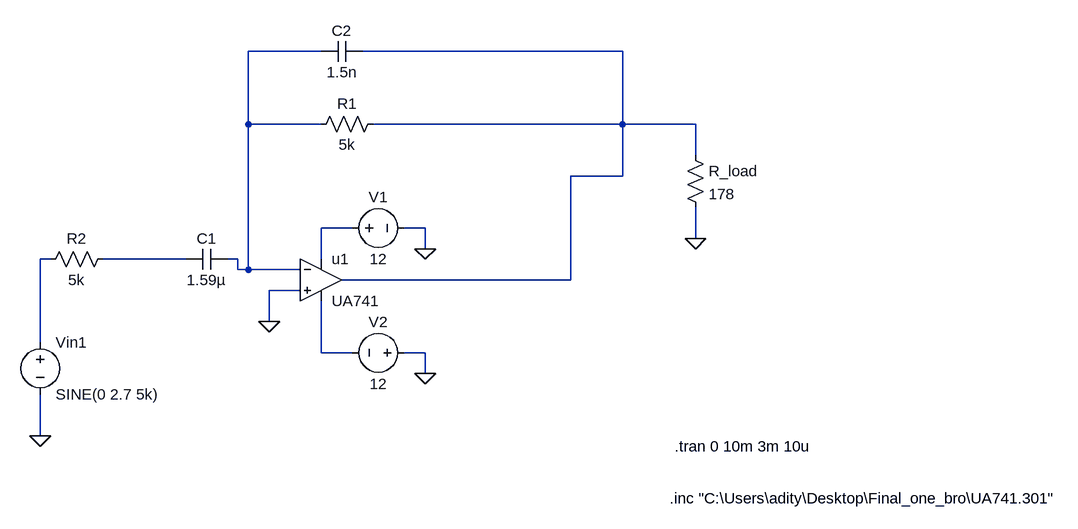
[diagram p0: schematic Filter.asc]
Filter.asc, the LTspice schematic file:
Version 4
SHEET 1 1340 680
WIRE 128 -144 16 -144
WIRE 592 -144 192 -144
WIRE 16 -32 16 -144
WIRE 128 -32 16 -32
WIRE 592 -32 592 -144
WIRE 592 -32 208 -32
WIRE 704 -32 592 -32
WIRE 704 16 704 -32
WIRE 592 48 592 -32
WIRE 592 48 512 48
WIRE 176 128 128 128
WIRE 288 128 256 128
WIRE 704 144 704 96
WIRE 288 160 288 128
WIRE -288 176 -304 176
WIRE -80 176 -208 176
WIRE 0 176 -16 176
WIRE 128 176 128 128
WIRE 0 192 0 176
WIRE 16 192 16 -32
WIRE 16 192 0 192
WIRE 96 192 16 192
WIRE 512 208 512 48
WIRE 512 208 160 208
WIRE 96 224 48 224
WIRE 48 272 48 224
WIRE -304 304 -304 176
WIRE 128 320 128 240
WIRE 176 320 128 320
WIRE 288 320 256 320
WIRE 288 352 288 320
WIRE -304 448 -304 384
FLAG 288 160 0
FLAG 288 352 0
FLAG 48 272 0
FLAG -304 448 0
FLAG 704 144 0
SYMBOL cap -16 160 R90
WINDOW 0 0 32 VBottom 2
WINDOW 3 32 32 VTop 2
SYMATTR InstName C1
SYMATTR Value 1.59µ
SYMBOL cap 192 -160 R90
WINDOW 0 0 32 VBottom 2
WINDOW 3 32 32 VTop 2
SYMATTR InstName C2
SYMATTR Value 1.5n
SYMBOL res 224 -48 R90
WINDOW 0 0 56 VBottom 2
WINDOW 3 32 56 VTop 2
SYMATTR InstName R1
SYMATTR Value 5k
SYMBOL res -192 160 R90
WINDOW 0 0 56 VBottom 2
WINDOW 3 32 56 VTop 2
SYMATTR InstName R2
SYMATTR Value 5k
SYMBOL OpAmps\\opamp2 128 144 R0
SYMATTR InstName u1
SYMATTR Value UA741
SYMBOL voltage 160 128 R270
WINDOW 0 32 56 VTop 2
WINDOW 3 -32 56 VBottom 2
WINDOW 123 0 0 Left 0
WINDOW 39 0 0 Left 0
SYMATTR InstName V1
SYMATTR Value 12
SYMBOL voltage 272 320 R90
WINDOW 0 -32 56 VBottom 2
WINDOW 3 32 56 VTop 2
WINDOW 123 0 0 Left 0
WINDOW 39 0 0 Left 0
SYMATTR InstName V2
SYMATTR Value 12
SYMBOL voltage -304 288 R0
WINDOW 123 0 0 Left 0
WINDOW 39 0 0 Left 0
SYMATTR InstName Vin1
SYMATTR Value SINE(0 2.7 5k)
SYMBOL res 688 0 R0
SYMATTR InstName R_load
SYMATTR Value 178
TEXT 672 464 Left 2 !.tran 0 10m 3m 10u
TEXT 664 544 Left 2 !.inc "C:\\Users\\adity\\Desktop\\Final_one_bro\\UA741.301"

The netlist it stands for:
* Filter.asc
C1 N001 N005 1.59µ
C2 N002 N001 1.5n
R1 N002 N001 5k
R2 N005 N004 5k
Xu1 0 N001 N003 N006 N002 UA741  ; pins In+ In- V+ V- OUT
V1 N003 0 12
V2 0 N006 12
Vin1 N004 0 SINE(0 2.7 5k)
R_load N002 0 178
.tran 0 10m 3m 10u
.inc "C:\Users\adity\Desktop\Final_one_bro\UA741.301"
.backanno
.end